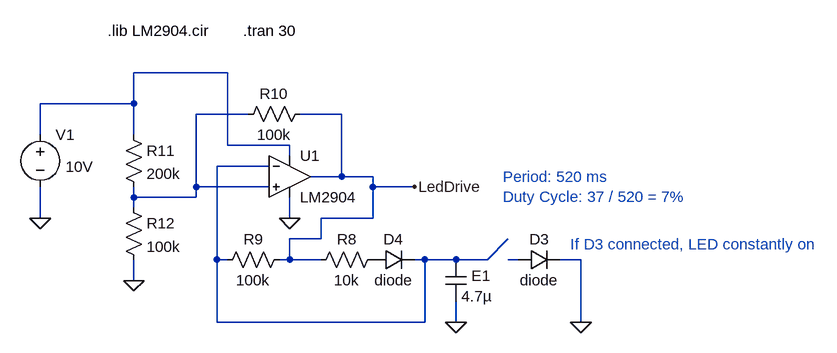
[diagram p0: schematic led-flash.asc]
led-flash.asc, the LTspice schematic file:
Version 4
SHEET 1 1136 680
WIRE 208 -16 64 -16
WIRE 64 32 64 -16
WIRE 64 32 -80 32
WIRE 240 48 160 48
WIRE 384 48 320 48
WIRE -80 80 -80 32
WIRE 64 80 64 32
WIRE 208 96 208 -16
WIRE 304 96 208 96
WIRE 304 112 304 96
WIRE 272 128 192 128
WIRE 384 144 384 48
WIRE 384 144 336 144
WIRE 432 144 384 144
WIRE 160 160 160 48
WIRE 272 160 160 160
WIRE 432 160 432 144
WIRE 496 160 432 160
WIRE 64 176 64 160
WIRE 160 176 160 160
WIRE 160 176 64 176
WIRE 64 192 64 176
WIRE -80 208 -80 160
WIRE 304 208 304 176
WIRE 432 208 432 160
WIRE 432 208 352 208
WIRE 352 240 352 208
WIRE 352 240 304 240
WIRE 192 272 192 128
WIRE 208 272 192 272
WIRE 304 272 304 240
WIRE 304 272 288 272
WIRE 352 272 304 272
WIRE 512 272 496 272
WIRE 560 272 512 272
WIRE 608 272 640 240
WIRE 608 272 560 272
WIRE 656 272 640 272
WIRE 752 272 720 272
WIRE 64 304 64 272
WIRE 192 368 192 272
WIRE 512 368 512 272
WIRE 512 368 192 368
WIRE 560 368 560 336
WIRE 752 368 752 272
FLAG 64 304 0
FLAG 560 368 0
FLAG 304 208 0
FLAG -80 208 0
FLAG 496 160 LedDrive
FLAG 752 368 0
SYMBOL res 48 64 R0
SYMATTR InstName R11
SYMATTR Value 200k
SYMBOL res 48 176 R0
SYMATTR InstName R12
SYMATTR Value 100k
SYMBOL res 336 32 R90
WINDOW 0 0 56 VBottom 2
WINDOW 3 32 56 VTop 2
SYMATTR InstName R10
SYMATTR Value 100k
SYMBOL voltage -80 64 R0
WINDOW 3 39 65 Left 2
WINDOW 123 0 0 Left 0
WINDOW 39 0 0 Left 0
SYMATTR Value 10V
SYMATTR InstName V1
SYMBOL Opamps\\opamp2 304 80 R0
SYMATTR InstName U1
SYMATTR Value LM2904
SYMBOL res 304 256 R90
WINDOW 0 0 56 VBottom 2
WINDOW 3 32 56 VTop 2
SYMATTR InstName R9
SYMATTR Value 100k
SYMBOL res 448 256 R90
WINDOW 0 0 56 VBottom 2
WINDOW 3 32 56 VTop 2
SYMATTR InstName R8
SYMATTR Value 10k
SYMBOL diode 432 288 R270
WINDOW 0 32 32 VTop 2
WINDOW 3 0 32 VBottom 2
SYMATTR InstName D4
SYMATTR Value diode
SYMBOL cap 544 272 R0
WINDOW 0 40 25 Left 2
SYMATTR InstName E1
SYMATTR Value 4.7µ
SYMBOL diode 656 288 R270
WINDOW 0 32 32 VTop 2
WINDOW 3 0 32 VBottom 2
SYMATTR InstName D3
SYMATTR Value diode
TEXT 24 -80 Left 2 !.lib LM2904.cir
TEXT 232 -80 Left 2 !.tran 30
TEXT 632 144 Left 2 ;Period: 520 ms\nDuty Cycle: 37 / 520 = 7%
TEXT 736 248 Left 2 ;If D3 connected, LED constantly on

The netlist it stands for:
* led-flash.asc
R11 N001 N002 200k
R12 N002 0 100k
R10 LedDrive N002 100k
V1 N001 0 10V
XU1 N002 N003 N001 0 LedDrive LM2904  ; pins In+ In- V+ V- OUT
R9 LedDrive N003 100k
R8 P001 LedDrive 10k
D4 P001 N003 diode
C§E1 N003 0 4.7µ
D3 N004 0 diode
.model D D
.lib standard.dio
.lib LM2904.cir
.tran 30
* Period: 520 ms
* Duty Cycle: 37 / 520 = 7%
* If D3 connected, LED constantly on
.backanno
.end